# EAGLE design Link_Base_Chip (EAGLE 9.6.2)
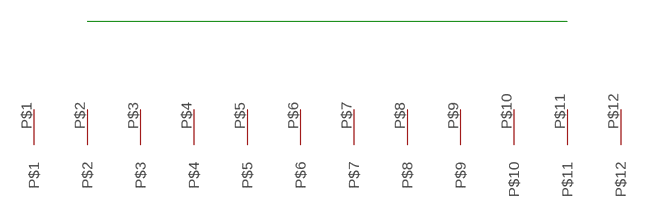
[diagram p0: schematic, sheet 1]

## Parts
U$1  BEAST  [BEAST]
Unconnected: U$1.P$1 U$1.P$2 U$1.P$3 U$1.P$4 U$1.P$5 U$1.P$6 U$1.P$7 U$1.P$8 U$1.P$9 U$1.P$10 U$1.P$11 U$1.P$12

## Library data of the parts
U$1 = beastpins:BEAST

## Board
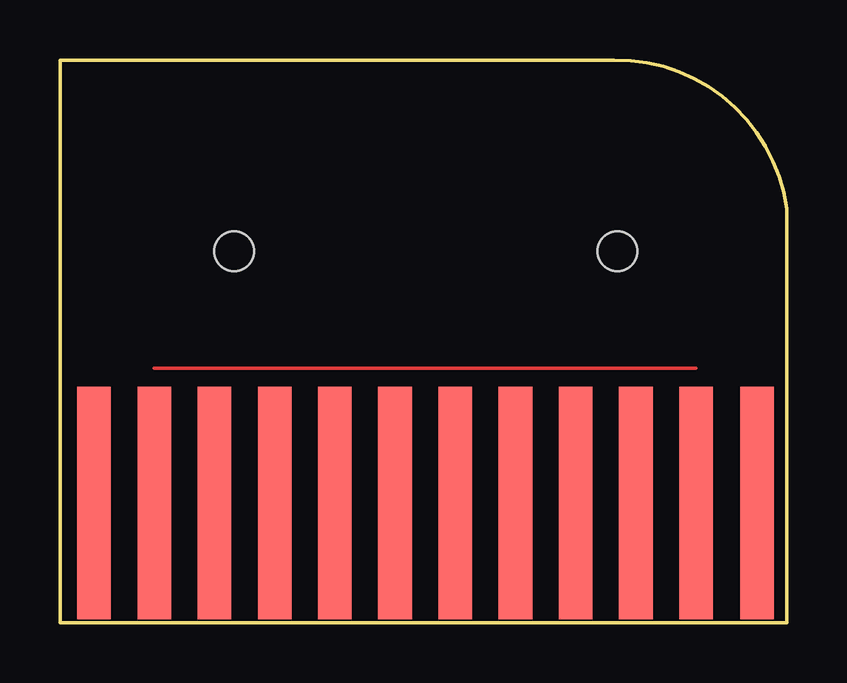
[diagram p1: board, top side]

Size 30.3 x 23.45 mm. Coordinates in mm from the lower left corner, seen from the top.
Outline: 0,0 30.3,0 30.3,17.25 arc83 23.1,23.45 0,23.45 0,0
Copper layers (1*16): Top 0.035mm / dielectric 1.5mm / Bottom 0.035mm
Design rules "default *": minimum track width 6mil, minimum drill 0.35mm, track to track 1mil, track to pad 6mil, pad to pad 6mil, via to via 6mil, smd to smd 6mil, copper to edge 0.002540625mm, drill to drill 1mil, minimum pad ring 10mil, minimum via ring 8mil, stop-mask expansion 4mil, vias tented up to drill 0mil, thermal gap 10mil
Holes 1.65 mm at 7.27,15.49 23.23,15.49

### Footprints (pad centres in the part's own frame; a part is rotated, then mirrored left to right if it is on the bottom)
BEAST = smd 1.4 x 9.7: P$1 -27.61,5.02; P$2 -25.1,5.02; P$3 -22.59,5.02; P$4 -20.08,5.02; P$5 -17.57,5.02; P$6 -15.06,5.02; P$7 -12.55,5.02; P$8 -10.04,5.02; P$9 -7.53,5.02; P$10 -5.02,5.02; P$11 -2.51,5.02; P$12 0.03,5.02

### Placement (x,y rotation side)
U$1  29.03,-0.03 0 top

### Tracks (layer width: path | path; a pad name or v marks a point on that pad's centre or on a via)
N$1
  Top 0.152: 3.93,10.6 26.52,10.6